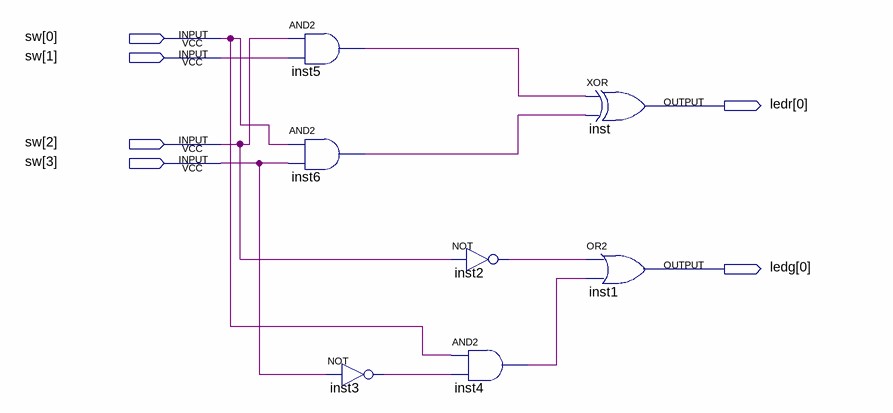
[diagram p0: schematic sheet]
// Quartus schematic Lab3.bdf as structural Verilog: 7 symbols, 6 pins
module Lab3 (
  input  [3:0] sw,
  output [0:0] ledr,
  output [0:0] ledg
);

  wire inst2_out, inst3_out, inst4_out, inst5_out, inst6_out;

  and inst5 (inst5_out, sw[2], sw[1]);
  and inst6 (inst6_out, sw[0], sw[3]);
  not inst3 (inst3_out, sw[3]);
  not inst2 (inst2_out, sw[2]);
  and inst4 (inst4_out, sw[0], inst3_out);
  xor inst (ledr[0], inst5_out, inst6_out);
  or inst1 (ledg[0], inst2_out, inst4_out);
endmodule
